# Altium schematic sheet Microcontroller.SchDoc
size B; Organization: Altium Limited; Address1: L3, 12a Rodborough Rd; Address2: Frenchs Forest; Address3: NSW; Address4: Australia 2086
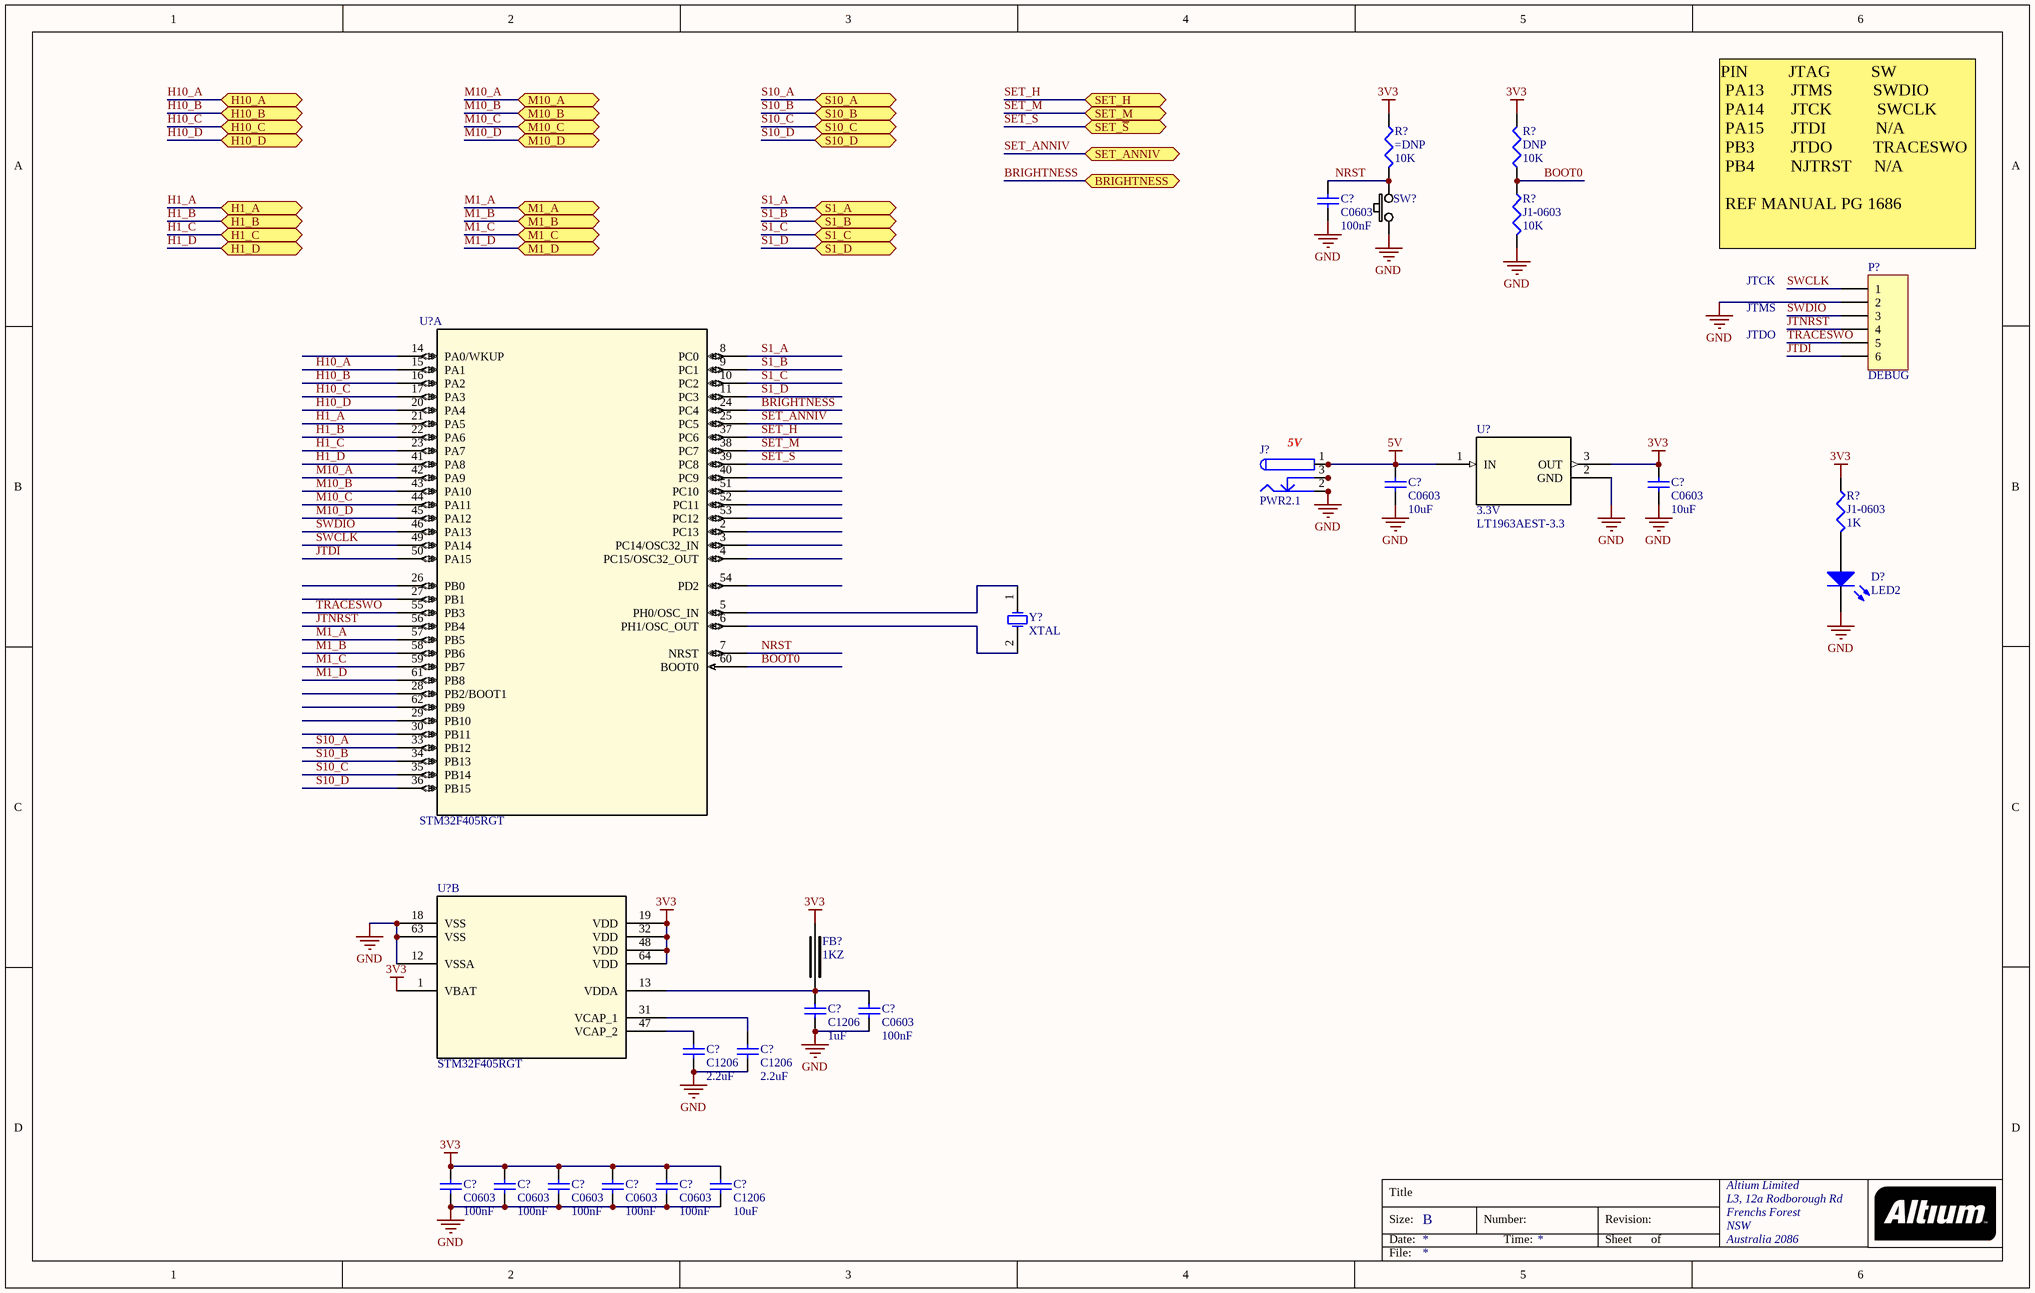
[diagram p0: Microcontroller.SchDoc]

## Parts
(Parts that share a designator on the sheet are numbered #1, #2 ... from top to bottom, then left to right.)
C?#1  C0603  value 100nF  [1608[0603]]
C?#2  C0603  value 10uF  [1608[0603]]
C?#3  C0603  value 10uF  [1608[0603]]
C?#4  C1206  value 1uF  [C1206]
C?#5  C0603  value 100nF  [1608[0603]]
C?#6  C1206  value 2.2uF  [C1206]
C?#7  C1206  value 2.2uF  [C1206]
C?#8  C0603  value 100nF  [1608[0603]]
C?#9  C0603  value 100nF  [1608[0603]]
C?#10  C0603  value 100nF  [1608[0603]]
C?#11  C0603  value 100nF  [1608[0603]]
C?#12  C0603  value 100nF  [1608[0603]]
C?#13  C1206  value 10uF  [C1206]
D?  LED2  [1608[0603] - LED]
FB?  1KZ  [0603FB-1KZ]
J?  PWR2.1  [KLD-0202]
P?  DEBUG  [HDR1X6]
R?#1  value 10K  [RESC1608X06N]
R?#2  DNP  value 10K  [RESC1608X06N]
R?#3  J1-0603  value 10K  [RESC1608X06N]
R?#4  J1-0603  value 1K  [RESC1608X06N]
SW?  SW-PB-BLACK-SMD  [SW-PB-SMD]  (value not drawn)
U?#1  STM32F405RGT  [LQFP64-10x10mm]  (part A of 2)
U?#2  3.3V  [SOT-223_ST]
U?#3  STM32F405RGT  [LQFP64-10x10mm]  (part B of 2)
Y?  XTAL  [R38]

## Ports
BRIGHTNESS, H1_A, H1_B, H1_C, H1_D, H10_A, H10_B, H10_C, H10_D, M1_A, M1_B, M1_C, M1_D, M10_A, M10_B, M10_C, M10_D, S1_A, S1_B, S1_C, S1_D, S10_A, S10_B, S10_C, S10_D, SET_ANNIV, SET_H, SET_M, SET_~{S}

## Nets
3V3: C?#3.2 C?#8.2 C?#9.2 C?#10.2 C?#11.2 C?#12.2 C?#13.2 FB?.1 R?#1.1 R?#2.2 R?#4.1 U?#2.3(OUT) U?#3.1(VBAT) U?#3.19(VDD) U?#3.32(VDD) U?#3.48(VDD) U?#3.64(VDD)
5V: C?#2.2 J?.1 J?.1A J?.1B U?#2.1(IN)
GND: C?#1.1 C?#2.1 C?#3.1 C?#4.1 C?#5.1 C?#6.1 C?#7.1 C?#8.1 C?#9.1 C?#10.1 C?#11.1 C?#12.1 C?#13.1 D?.2(K) J?.2 J?.2A J?.2B P?.2 R?#3.2 SW?.1 U?#2.2(GND) U?#3.12(VSSA) U?#3.18(VSS) U?#3.63(VSS)
BOOT0: R?#2.1 R?#3.1 U?#1.60(BOOT0)
BRIGHTNESS: U?#1.24(PC4) ; port BRIGHTNESS
H1_A: U?#1.21(PA5) ; port H1_A
H1_B: U?#1.22(PA6) ; port H1_B
H1_C: U?#1.23(PA7) ; port H1_C
H1_D: U?#1.41(PA8) ; port H1_D
H10_A: U?#1.15(PA1) ; port H10_A
H10_B: U?#1.16(PA2) ; port H10_B
H10_C: U?#1.17(PA3) ; port H10_C
H10_D: U?#1.20(PA4) ; port H10_D
JTDI: P?.6 U?#1.50(PA15)
JTNRST: P?.4 U?#1.56(PB4)
M1_A: U?#1.57(PB5) ; port M1_A
M1_B: U?#1.58(PB6) ; port M1_B
M1_C: U?#1.59(PB7) ; port M1_C
M1_D: U?#1.61(PB8) ; port M1_D
M10_A: U?#1.42(PA9) ; port M10_A
M10_B: U?#1.43(PA10) ; port M10_B
M10_C: U?#1.44(PA11) ; port M10_C
M10_D: U?#1.45(PA12) ; port M10_D
NRST: C?#1.2 R?#1.2 SW?.2 U?#1.7(NRST)
S1_A: U?#1.8(PC0) ; port S1_A
S1_B: U?#1.9(PC1) ; port S1_B
S1_C: U?#1.10(PC2) ; port S1_C
S1_D: U?#1.11(PC3) ; port S1_D
S10_A: U?#1.33(PB12) ; port S10_A
S10_B: U?#1.34(PB13) ; port S10_B
S10_C: U?#1.35(PB14) ; port S10_C
S10_D: U?#1.36(PB15) ; port S10_D
SET_ANNIV: U?#1.25(PC5) ; port SET_ANNIV
SET_H: U?#1.37(PC6) ; port SET_H
SET_M: U?#1.38(PC7) ; port SET_M
SET_S: U?#1.39(PC8) ; port SET_~{S}
SWCLK: P?.1 U?#1.49(PA14)
SWDIO: P?.3 U?#1.46(PA13)
TRACESWO: P?.5 U?#1.55(PB3)
NetC?#4_2: C?#4.2 C?#5.2 FB?.2 U?#3.13(VDDA)
NetC?#6_2: C?#6.2 U?#3.47(VCAP_2)
NetC?#7_2: C?#7.2 U?#3.31(VCAP_1)
NetD?_1: D?.1(A) R?#4.2
NetJ?_3: J?.3 J?.3A J?.3B
NetU?#1_5: U?#1.5(PH0/OSC_IN) Y?.1(OSC1)
NetU?#1_6: U?#1.6(PH1/OSC_OUT) Y?.2(OSC2)

Not connected (* = marked no-connect by the designer): U?#1 2(PC13) 3(PC14/OSC32_IN) 4(PC15/OSC32_OUT) 14(PA0/WKUP) 26(PB0) 27(PB1) 28(PB2/BOOT1) 29(PB10) 30(PB11) 40(PC9) 51(PC10) 52(PC11) 53(PC12) 54(PD2) 62(PB9)

## Notes on the sheet
- (near P?) PIN         JTAG         SW
  PA13      JTMS         SWDIO
  PA14      JTCK          SWCLK
  PA15      JTDI           N/A
  PB3        JTDO         TRACESWO
  PB4        NJTRST     N/A
  REF MANUAL PG 1686
- JTCK
- JTMS
- JTDO
- (near J?) 5V
- Title
- Size:
- Date:
- B
- Number:
- Time:
- Revision:
- Sheet
- of
- File:

## Library data of the parts
C?#1-C?#13 = Cap Semi: Capacitor (Semiconductor SIM Model); Published: 8-Jun-2000; LatestRevisionDate: 29-May-2009; LatestRevisionNote: IPC-7351 Footprint Added.; Publisher: Altium Limited; PackageDescription: Chip Capacitor
  C?#1-C?#3 C?#5 C?#8-C?#12: PackageReference: C0603
  C?#4 C?#6 C?#7 C?#13: PackageReference: C1206
D? = LED2: Typical RED, GREEN, YELLOW, AMBER GaAs LED; PartNumber: APT1608EC; 19-213-R6C-AP1Q2B/3T: PartNumber; Published: 8-Jun-2000; LatestRevisionDate: 17-Jul-2002; LatestRevisionNote: Re-released for DXP Platform.; PackageVersion: Feb-2002; PackageReference: 3.2X1.6X1.1; Publisher: Altium Limited; PackageDescription: SM LED; 2 Flat Leads
FB? = 0603FB-1KZ: FERRITE BEAD 1000 OHM 400mA; Manufacturer: TDK Corporation; Manufacturer Part Number: MMZ1608R102A; Reel: F1; Description: FERRITE CHIP 1000 OHM 400MA 0603; Supplier 1: Digi-Key; Supplier Part Number 1: 445-1548-2-ND
J? = PWR2.5: Low Voltage Power Supply Connector; Published: 17-Dec-2003; DatasheetDocument: 09-May-2002; Publisher: Altium Limited; ComponentLink1Description: Manufacturer Link; ComponentLink1URL: http://domino.kycon.com/internet/Products.html
P? = Header 6: Header, 6-Pin; LatestRevisionDate: 17-Jul-2002; LatestRevisionNote: Re-released for DXP Platform.; Publisher: Altium Limited
R?#1-R?#4 = Res3: Resistor; Published: 8-Jun-2000; LatestRevisionDate: 29-May-2009; LatestRevisionNote: IPC-7351 Footprint Added.; PackageReference: J1-0603; Publisher: Altium Limited; PackageDescription: Chip Resistor
SW? = SW-PB-BLACK-SMD: PUSHBUTTON SWITCH 6MM SMD
U?#1 U?#3 = STM32F4x5RG: No Description Available; Vendor: STMicroelectronics; PartNumber: STM32F405RGT; Copyright: Copyright (C) 2016 Accelerated Designs. All rights reserved; RefDes: RefDes; Type: DEV; Value: Value
U?#2 = LT1963AEST-3.3: No Description Available; Vendor: Linear Technology; Manufacturer_Part_Number: LT1963AEST-3.3; Copyright: Copyright (C) 2018 Accelerated Designs. All rights reserved; RefDes: RefDes; Type: DEV; Value: 3.3V; PartNumber: LT1963AEST-3.3
Y? = XTAL: Crystal Oscillator; Published: 8-Jun-2000; LatestRevisionDate: 17-Jul-2002; LatestRevisionNote: Re-released for DXP Platform.; PackageReference: R38; Publisher: Altium Limited; PackageDescription: Crystal, Thru-Hole; 2 Leads; Body 3.1 x 8.2 mm (Dia.xH)